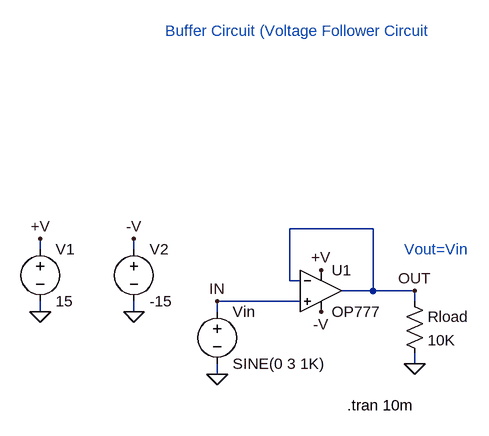
[diagram p0: schematic Buffer Circuit.asc]
Buffer Circuit.asc, the LTspice schematic file:
Version 4
SHEET 1 1404 700
WIRE 656 -1200 528 -1200
WIRE 144 -1168 144 -1184
WIRE 288 -1168 288 -1184
WIRE 528 -1120 528 -1200
WIRE 544 -1120 528 -1120
WIRE 656 -1104 656 -1200
WIRE 656 -1104 608 -1104
WIRE 720 -1104 656 -1104
WIRE 544 -1088 416 -1088
WIRE 720 -1088 720 -1104
WIRE 144 -1072 144 -1088
WIRE 288 -1072 288 -1088
WIRE 416 -1072 416 -1088
WIRE 720 -992 720 -1008
WIRE 416 -976 416 -992
FLAG 144 -1184 +V
FLAG 144 -1072 0
FLAG 416 -976 0
FLAG 720 -1104 OUT
FLAG 416 -1088 IN
FLAG 576 -1136 +V
FLAG 288 -1184 -V
FLAG 576 -1072 -V
FLAG 720 -992 0
FLAG 288 -1072 0
SYMBOL voltage 144 -1184 R0
WINDOW 123 0 0 Left 2
WINDOW 39 0 0 Left 2
SYMATTR InstName V1
SYMATTR Value 15
SYMBOL voltage 416 -1088 R0
WINDOW 123 24 146 Left 2
WINDOW 39 24 125 Left 2
SYMATTR InstName Vin
SYMATTR Value SINE(0 3 1K)
SYMBOL Opamps\\OP777 576 -1168 R0
SYMATTR InstName U1
SYMBOL voltage 288 -1184 R0
WINDOW 123 24 146 Left 2
WINDOW 39 24 125 Left 2
SYMATTR InstName V2
SYMATTR Value -15
SYMBOL res 704 -1104 R0
SYMATTR InstName Rload
SYMATTR Value 10K
TEXT 616 -928 Left 2 !.tran 10m
TEXT 704 -1168 Left 2 ;Vout=Vin
TEXT 336 -1504 Left 2 ;Buffer Circuit (Voltage Follower Circuit

The netlist it stands for:
* Buffer Circuit.asc
V1 +V 0 15
Vin IN 0 SINE(0 3 1K)
XU1 IN OUT +V -V OUT OP777  ; pins In+ In- V+ V- OUT
V2 -V 0 -15
Rload OUT 0 10K
.tran 10m
* Vout=Vin
* Buffer Circuit (Voltage Follower Circuit
.lib ADI.lib
.backanno
.end

* Results of the author's LTspice run, read from the files saved beside the schematic
* Operating Point, zero values left out:
*   V(+v) = 15 V
*   V(out) = 80 µV
*   V(-v) = -15 V
*   I(Rload) = 8 nA
*   I(V2) = 304.4 µA
*   I(Vin) = 10.86 nA
*   I(V1) = -304.4 µA
*   Ix(u1:1) = -10.86 nA
*   Ix(u1:2) = -8.856 nA
*   Ix(u1:99) = 304.4 µA
*   Ix(u1:50) = -304.4 µA
*   Ix(u1:45) = 856.4 pA
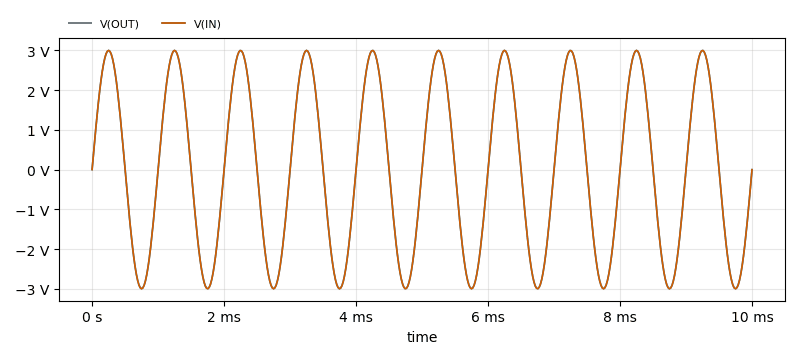
[diagram p1: Transient Analysis of Buffer Circuit.asc, plotted from the saved traces]
* Transient Analysis, 1 run:
*   V(OUT): min -2.997 V, max 2.997 V, average 77.45 µV, rms 2.119 V, last -4.332 mV
*   V(IN): min -3 V, max 3 V, average -2.708 µV, rms 2.121 V, last 0 V